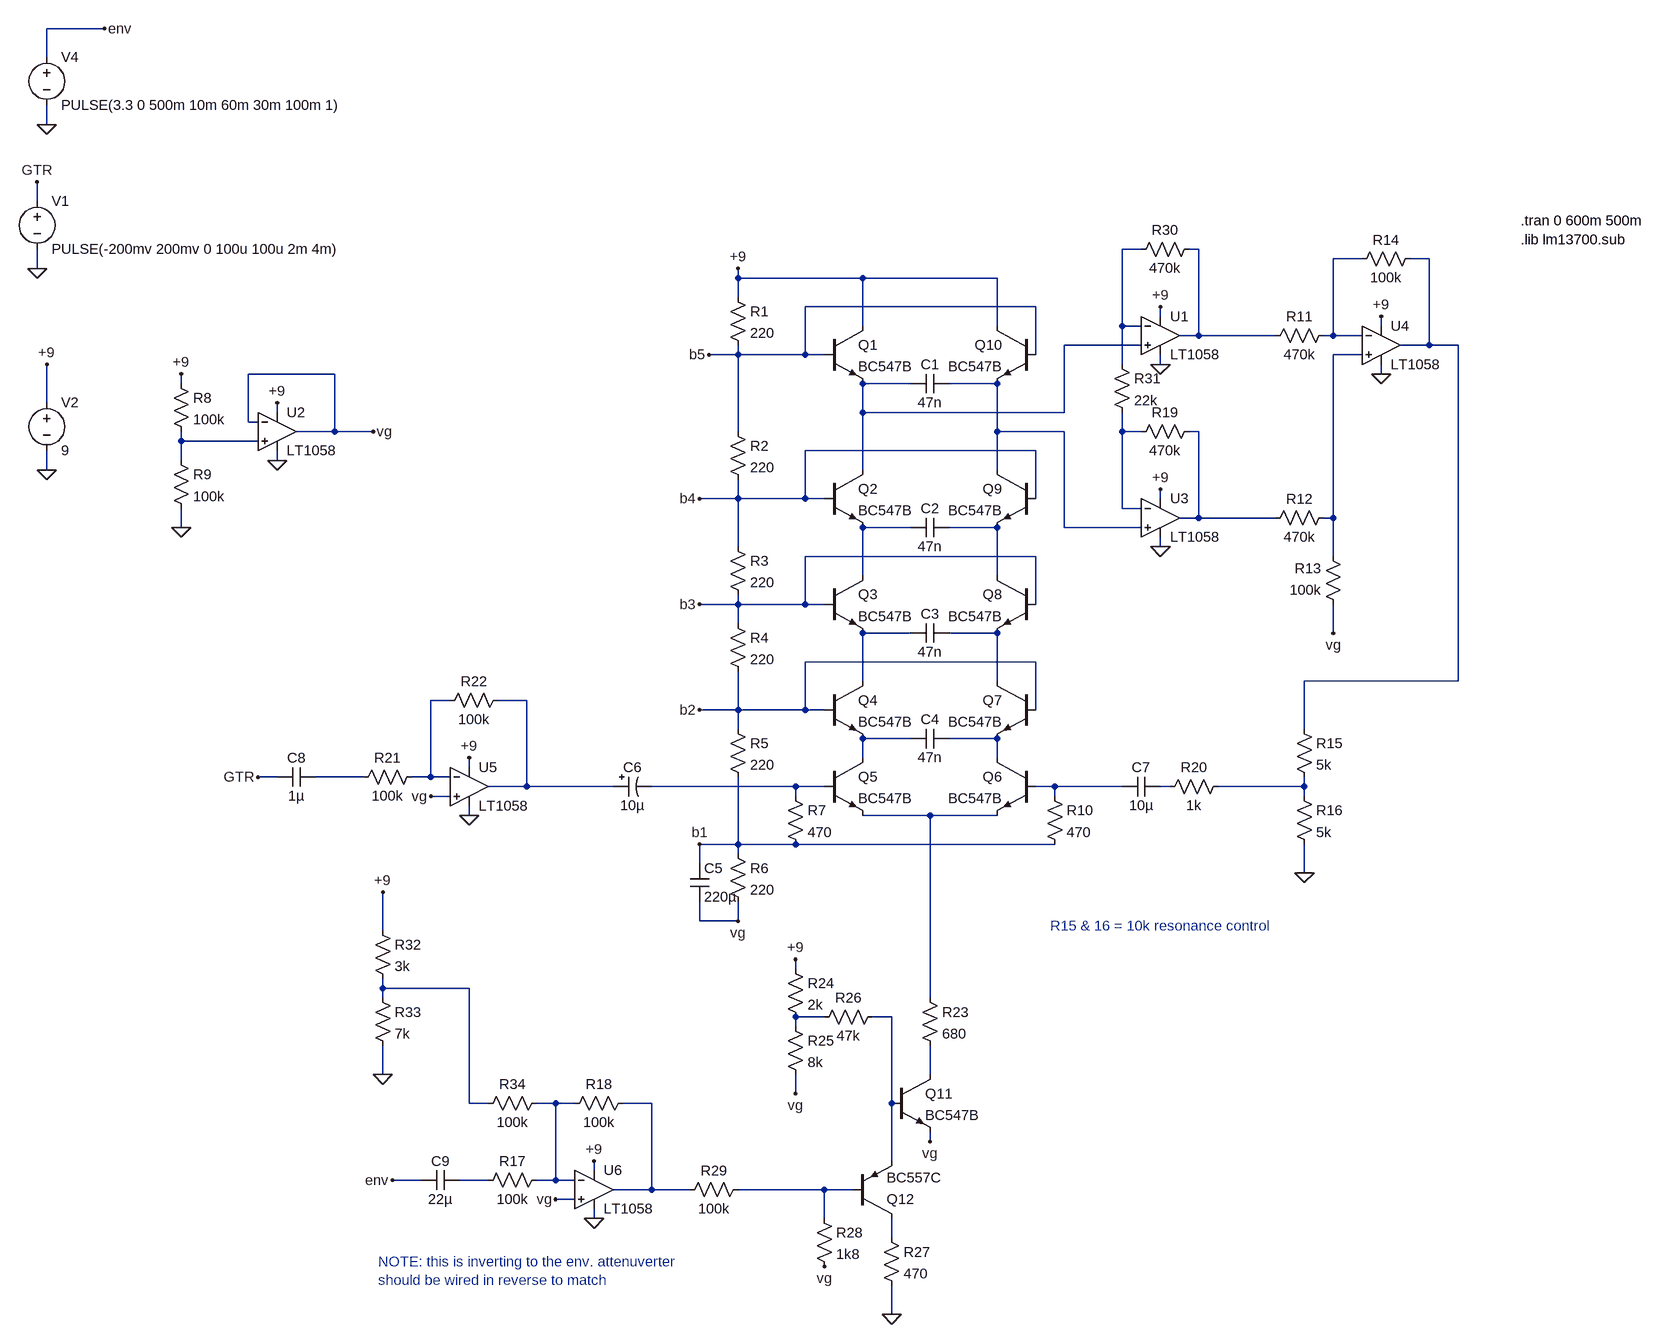
[diagram p0: schematic LadderFilterSim.asc]
LadderFilterSim.asc, the LTspice schematic file:
Version 4
SHEET 1 3420 5796
WIRE -3584 -208 -3680 -208
WIRE -3680 -160 -3680 -208
WIRE -3680 -48 -3680 -80
WIRE -3696 80 -3696 48
WIRE -1856 160 -1888 160
WIRE -1760 160 -1776 160
WIRE -1488 176 -1536 176
WIRE -1376 176 -1408 176
WIRE -3696 192 -3696 160
WIRE -2528 208 -2528 192
WIRE -2320 208 -2528 208
WIRE -2096 208 -2320 208
WIRE -2528 240 -2528 208
WIRE -2032 256 -2416 256
WIRE -1824 272 -1824 256
WIRE -2320 288 -2320 208
WIRE -2096 288 -2096 208
WIRE -1888 288 -1888 160
WIRE -1856 288 -1888 288
WIRE -1456 288 -1456 272
WIRE -1760 304 -1760 160
WIRE -1760 304 -1792 304
WIRE -1632 304 -1760 304
WIRE -1536 304 -1536 176
WIRE -1536 304 -1552 304
WIRE -1488 304 -1536 304
WIRE -1856 320 -1984 320
WIRE -1376 320 -1376 176
WIRE -1376 320 -1424 320
WIRE -1328 320 -1376 320
WIRE -2528 336 -2528 320
WIRE -2528 336 -2576 336
WIRE -2416 336 -2416 256
WIRE -2416 336 -2528 336
WIRE -2384 336 -2416 336
WIRE -2032 336 -2032 256
WIRE -1488 336 -1536 336
WIRE -1888 352 -1888 288
WIRE -1824 352 -1824 336
WIRE -3200 368 -3344 368
WIRE -1456 368 -1456 352
WIRE -3456 384 -3456 368
WIRE -2240 384 -2320 384
WIRE -2096 384 -2176 384
WIRE -3680 416 -3680 352
WIRE -3296 432 -3296 416
WIRE -2320 432 -2320 384
WIRE -1984 432 -1984 320
WIRE -1984 432 -2320 432
WIRE -3344 448 -3344 368
WIRE -3328 448 -3344 448
WIRE -3200 464 -3200 368
WIRE -3200 464 -3264 464
WIRE -3136 464 -3200 464
WIRE -2528 464 -2528 336
WIRE -2096 464 -2096 384
WIRE -1984 464 -2096 464
WIRE -1888 464 -1888 432
WIRE -1856 464 -1888 464
WIRE -1760 464 -1776 464
WIRE -3456 480 -3456 464
WIRE -3328 480 -3456 480
WIRE -2032 496 -2416 496
WIRE -3456 512 -3456 480
WIRE -3296 512 -3296 496
WIRE -3680 528 -3680 496
WIRE -2320 528 -2320 432
WIRE -2096 528 -2096 464
WIRE -2528 576 -2528 544
WIRE -2528 576 -2592 576
WIRE -2416 576 -2416 496
WIRE -2416 576 -2528 576
WIRE -2384 576 -2416 576
WIRE -2032 576 -2032 496
WIRE -1824 576 -1824 560
WIRE -1888 592 -1888 464
WIRE -1856 592 -1888 592
WIRE -1760 608 -1760 464
WIRE -1760 608 -1792 608
WIRE -1632 608 -1760 608
WIRE -1536 608 -1536 336
WIRE -1536 608 -1552 608
WIRE -3456 624 -3456 592
WIRE -2240 624 -2320 624
WIRE -2096 624 -2176 624
WIRE -1984 624 -1984 464
WIRE -1856 624 -1984 624
WIRE -2528 656 -2528 576
WIRE -1824 656 -1824 640
WIRE -2032 672 -2416 672
WIRE -1536 672 -1536 608
WIRE -2320 704 -2320 624
WIRE -2096 704 -2096 624
WIRE -2528 752 -2528 736
WIRE -2528 752 -2592 752
WIRE -2416 752 -2416 672
WIRE -2416 752 -2528 752
WIRE -2384 752 -2416 752
WIRE -2032 752 -2032 672
WIRE -2528 784 -2528 752
WIRE -2240 800 -2320 800
WIRE -2096 800 -2176 800
WIRE -1536 800 -1536 752
WIRE -2032 848 -2416 848
WIRE -2320 880 -2320 800
WIRE -2096 880 -2096 800
WIRE -1328 880 -1328 320
WIRE -1328 880 -1584 880
WIRE -3008 912 -3040 912
WIRE -2880 912 -2928 912
WIRE -2528 928 -2528 864
WIRE -2528 928 -2592 928
WIRE -2416 928 -2416 848
WIRE -2416 928 -2528 928
WIRE -2384 928 -2416 928
WIRE -2032 928 -2032 848
WIRE -2528 960 -2528 928
WIRE -1584 960 -1584 880
WIRE -2240 976 -2320 976
WIRE -2096 976 -2176 976
WIRE -2320 1008 -2320 976
WIRE -2096 1008 -2096 976
WIRE -2976 1024 -2976 1008
WIRE -3296 1040 -3328 1040
WIRE -3152 1040 -3232 1040
WIRE -3040 1040 -3040 912
WIRE -3040 1040 -3072 1040
WIRE -3008 1040 -3040 1040
WIRE -2880 1056 -2880 912
WIRE -2880 1056 -2944 1056
WIRE -2736 1056 -2880 1056
WIRE -2432 1056 -2672 1056
WIRE -2384 1056 -2432 1056
WIRE -2000 1056 -2032 1056
WIRE -1888 1056 -2000 1056
WIRE -1808 1056 -1824 1056
WIRE -1584 1056 -1584 1040
WIRE -1584 1056 -1728 1056
WIRE -3008 1072 -3040 1072
WIRE -2432 1072 -2432 1056
WIRE -2000 1072 -2000 1056
WIRE -1584 1072 -1584 1056
WIRE -2976 1104 -2976 1088
WIRE -2208 1104 -2320 1104
WIRE -2096 1104 -2208 1104
WIRE -2528 1152 -2528 1040
WIRE -2528 1152 -2592 1152
WIRE -2432 1152 -2528 1152
WIRE -2000 1152 -2432 1152
WIRE -2528 1168 -2528 1152
WIRE -2592 1184 -2592 1152
WIRE -1584 1200 -1584 1152
WIRE -2592 1280 -2592 1248
WIRE -2528 1280 -2528 1248
WIRE -2528 1280 -2592 1280
WIRE -3120 1296 -3120 1232
WIRE -2432 1360 -2432 1344
WIRE -3120 1392 -3120 1376
WIRE -2976 1392 -3120 1392
WIRE -3120 1408 -3120 1392
WIRE -2208 1408 -2208 1104
WIRE -2384 1440 -2432 1440
WIRE -2272 1440 -2304 1440
WIRE -2432 1456 -2432 1440
WIRE -3120 1536 -3120 1488
WIRE -2208 1536 -2208 1488
WIRE -2432 1568 -2432 1536
WIRE -2976 1584 -2976 1392
WIRE -2944 1584 -2976 1584
WIRE -2832 1584 -2864 1584
WIRE -2800 1584 -2832 1584
WIRE -2672 1584 -2720 1584
WIRE -2272 1584 -2272 1440
WIRE -2208 1648 -2208 1632
WIRE -2272 1680 -2272 1584
WIRE -2768 1696 -2768 1680
WIRE -3056 1712 -3104 1712
WIRE -2944 1712 -2992 1712
WIRE -2832 1712 -2832 1584
WIRE -2832 1712 -2864 1712
WIRE -2800 1712 -2832 1712
WIRE -2672 1728 -2672 1584
WIRE -2672 1728 -2736 1728
WIRE -2608 1728 -2672 1728
WIRE -2384 1728 -2528 1728
WIRE -2336 1728 -2384 1728
WIRE -2800 1744 -2832 1744
WIRE -2768 1776 -2768 1760
WIRE -2384 1776 -2384 1728
WIRE -2272 1808 -2272 1776
WIRE -2272 1936 -2272 1888
FLAG -3680 352 +9
FLAG -3680 -48 0
FLAG -3584 -208 env
FLAG -3696 192 0
FLAG -3696 48 GTR
FLAG -3296 416 +9
FLAG -3136 464 vg
FLAG -3456 368 +9
FLAG -3456 624 0
FLAG -2528 192 +9
FLAG -2528 1280 vg
FLAG -2592 1152 b1
FLAG -2592 928 b2
FLAG -2592 752 b3
FLAG -2592 576 b4
FLAG -2576 336 b5
FLAG -3680 528 0
FLAG -3328 1040 GTR
FLAG -3296 512 0
FLAG -1824 256 +9
FLAG -1824 352 0
FLAG -1824 560 +9
FLAG -1824 656 0
FLAG -1456 272 +9
FLAG -1456 368 0
FLAG -1536 800 vg
FLAG -1584 1200 0
FLAG -2976 1008 +9
FLAG -2976 1104 0
FLAG -3040 1072 vg
FLAG -2432 1344 +9
FLAG -2272 1936 0
FLAG -2384 1856 vg
FLAG -2432 1568 vg
FLAG -2208 1648 vg
FLAG -2768 1680 +9
FLAG -2768 1776 0
FLAG -2832 1744 vg
FLAG -3104 1712 env
FLAG -3120 1536 0
FLAG -3120 1232 +9
SYMBOL voltage -3680 400 R0
SYMATTR InstName V2
SYMATTR Value 9
SYMBOL voltage -3680 -176 R0
SYMATTR InstName V4
SYMATTR Value PULSE(3.3 0 500m 10m 60m 30m 100m 1)
SYMBOL voltage -3696 64 R0
SYMATTR InstName V1
SYMATTR Value PULSE(-200mv 200mv 0 100u 100u 2m 4m)
SYMBOL OpAmps/LT1058 -3296 400 R0
SYMATTR InstName U2
SYMBOL res -3472 368 R0
SYMATTR InstName R8
SYMATTR Value 100k
SYMBOL res -3472 496 R0
SYMATTR InstName R9
SYMATTR Value 100k
SYMBOL res -2544 224 R0
SYMATTR InstName R1
SYMATTR Value 220
SYMBOL res -2544 448 R0
SYMATTR InstName R2
SYMATTR Value 220
SYMBOL res -2544 640 R0
SYMATTR InstName R3
SYMATTR Value 220
SYMBOL res -2544 768 R0
SYMATTR InstName R4
SYMATTR Value 220
SYMBOL res -2544 944 R0
SYMATTR InstName R5
SYMATTR Value 220
SYMBOL res -2544 1152 R0
SYMATTR InstName R6
SYMATTR Value 220
SYMBOL npn -2384 288 R0
SYMATTR InstName Q1
SYMATTR Value BC547B
SYMBOL cap -2176 368 R90
WINDOW 0 0 32 VBottom 2
WINDOW 3 32 32 VTop 2
SYMATTR InstName C1
SYMATTR Value 47n
SYMBOL cap -2176 608 R90
WINDOW 0 0 32 VBottom 2
WINDOW 3 32 32 VTop 2
SYMATTR InstName C2
SYMATTR Value 47n
SYMBOL cap -2176 784 R90
WINDOW 0 0 32 VBottom 2
WINDOW 3 32 32 VTop 2
SYMATTR InstName C3
SYMATTR Value 47n
SYMBOL cap -2176 960 R90
WINDOW 0 0 32 VBottom 2
WINDOW 3 32 32 VTop 2
SYMATTR InstName C4
SYMATTR Value 47n
SYMBOL res -2448 1056 R0
SYMATTR InstName R7
SYMATTR Value 470
SYMBOL res -2016 1056 R0
SYMATTR InstName R10
SYMATTR Value 470
SYMBOL cap -2608 1184 R0
SYMATTR InstName C5
SYMATTR Value 220µ
SYMBOL OpAmps/LT1058 -1824 240 R0
SYMATTR InstName U1
SYMBOL OpAmps/LT1058 -1824 544 R0
SYMATTR InstName U3
SYMBOL OpAmps/LT1058 -1456 256 R0
SYMATTR InstName U4
SYMBOL res -1536 288 R90
WINDOW 0 0 56 VBottom 2
WINDOW 3 32 56 VTop 2
SYMATTR InstName R11
SYMATTR Value 470k
SYMBOL res -1536 592 R90
WINDOW 0 0 56 VBottom 2
WINDOW 3 32 56 VTop 2
SYMATTR InstName R12
SYMATTR Value 470k
SYMBOL res -1520 768 R180
WINDOW 0 36 76 Left 2
WINDOW 3 36 40 Left 2
SYMATTR InstName R13
SYMATTR Value 100k
SYMBOL res -1504 192 R270
WINDOW 0 32 56 VTop 2
WINDOW 3 0 56 VBottom 2
SYMATTR InstName R14
SYMATTR Value 100k
SYMBOL res -1600 944 R0
SYMATTR InstName R15
SYMATTR Value 5k
SYMBOL res -1600 1056 R0
SYMATTR InstName R16
SYMATTR Value 5k
SYMBOL npn -2384 528 R0
SYMATTR InstName Q2
SYMATTR Value BC547B
SYMBOL npn -2384 704 R0
SYMATTR InstName Q3
SYMATTR Value BC547B
SYMBOL npn -2384 880 R0
SYMATTR InstName Q4
SYMATTR Value BC547B
SYMBOL npn -2384 1008 R0
SYMATTR InstName Q5
SYMATTR Value BC547B
SYMBOL npn -2032 1008 M0
SYMATTR InstName Q6
SYMATTR Value BC547B
SYMBOL npn -2032 880 M0
SYMATTR InstName Q7
SYMATTR Value BC547B
SYMBOL npn -2032 704 M0
SYMATTR InstName Q8
SYMATTR Value BC547B
SYMBOL npn -2032 528 M0
SYMATTR InstName Q9
SYMATTR Value BC547B
SYMBOL npn -2032 288 M0
SYMATTR InstName Q10
SYMATTR Value BC547B
SYMBOL cap -1824 1040 R90
WINDOW 0 0 32 VBottom 2
WINDOW 3 32 32 VTop 2
SYMATTR InstName C7
SYMATTR Value 10µ
SYMBOL res -1712 1040 R90
WINDOW 0 0 56 VBottom 2
WINDOW 3 32 56 VTop 2
SYMATTR InstName R20
SYMATTR Value 1k
SYMBOL OpAmps/LT1058 -2976 992 R0
SYMATTR InstName U5
SYMBOL res -3056 1024 R90
WINDOW 0 0 56 VBottom 2
WINDOW 3 32 56 VTop 2
SYMATTR InstName R21
SYMATTR Value 100k
SYMBOL res -2912 896 R90
WINDOW 0 0 56 VBottom 2
WINDOW 3 32 56 VTop 2
SYMATTR InstName R22
SYMATTR Value 100k
SYMBOL cap -3232 1024 R90
WINDOW 0 0 32 VBottom 2
WINDOW 3 32 32 VTop 2
SYMATTR InstName C8
SYMATTR Value 1µ
SYMBOL npn -2272 1536 R0
SYMATTR InstName Q11
SYMATTR Value BC547B
SYMBOL res -2224 1392 R0
SYMATTR InstName R23
SYMATTR Value 680
SYMBOL res -2448 1344 R0
SYMATTR InstName R24
SYMATTR Value 2k
SYMBOL res -2448 1440 R0
SYMATTR InstName R25
SYMATTR Value 8k
SYMBOL res -2288 1424 R90
WINDOW 0 0 56 VBottom 2
WINDOW 3 32 56 VTop 2
SYMATTR InstName R26
SYMATTR Value 47k
SYMBOL pnp -2336 1776 M180
SYMATTR InstName Q12
SYMATTR Value BC557C
SYMBOL res -2288 1792 R0
SYMATTR InstName R27
SYMATTR Value 470
SYMBOL res -2400 1760 R0
SYMATTR InstName R28
SYMATTR Value 1k8
SYMBOL res -2512 1712 R90
WINDOW 0 0 56 VBottom 2
WINDOW 3 32 56 VTop 2
SYMATTR InstName R29
SYMATTR Value 100k
SYMBOL res -1760 448 R90
WINDOW 0 0 56 VBottom 2
WINDOW 3 32 56 VTop 2
SYMATTR InstName R19
SYMATTR Value 470k
SYMBOL res -1760 144 R90
WINDOW 0 0 56 VBottom 2
WINDOW 3 32 56 VTop 2
SYMATTR InstName R30
SYMATTR Value 470k
SYMBOL res -1904 336 R0
SYMATTR InstName R31
SYMATTR Value 22k
SYMBOL polcap -2736 1040 M90
WINDOW 0 0 32 VBottom 2
WINDOW 3 32 32 VTop 2
SYMATTR InstName C6
SYMATTR Value 10µ
SYMBOL OpAmps/LT1058 -2768 1664 R0
SYMATTR InstName U6
SYMBOL res -2848 1696 R90
WINDOW 0 0 56 VBottom 2
WINDOW 3 32 56 VTop 2
SYMATTR InstName R17
SYMATTR Value 100k
SYMBOL res -2704 1568 R90
WINDOW 0 0 56 VBottom 2
WINDOW 3 32 56 VTop 2
SYMATTR InstName R18
SYMATTR Value 100k
SYMBOL cap -2992 1696 R90
WINDOW 0 0 32 VBottom 2
WINDOW 3 32 32 VTop 2
SYMATTR InstName C9
SYMATTR Value 22µ
SYMBOL res -3136 1280 R0
SYMATTR InstName R32
SYMATTR Value 3k
SYMBOL res -3136 1392 R0
SYMATTR InstName R33
SYMATTR Value 7k
SYMBOL res -2848 1568 R90
WINDOW 0 0 56 VBottom 2
WINDOW 3 32 56 VTop 2
SYMATTR InstName R34
SYMATTR Value 100k
TEXT -40 112 Left 2 !.tran 0 600m 500m
TEXT -40 144 Left 2 !.lib lm13700.sub
TEXT -2008 1288 Left 2 ;R15 & 16 = 10k resonance control
TEXT -3128 1848 Left 2 ;NOTE: this is inverting to the env. attenuverter\nshould be wired in reverse to match

The netlist it stands for:
* LadderFilterSim.asc
V2 +9 0 9
V4 env 0 PULSE(3.3 0 500m 10m 60m 30m 100m 1)
V1 GTR 0 PULSE(-200mv 200mv 0 100u 100u 2m 4m)
XU2 N010 vg +9 0 vg LT1057  ; LT1058, pins In+ In- V+ V- OUT
R8 +9 N010 100k
R9 N010 0 100k
R1 +9 b5 220
R2 b5 b4 220
R3 b4 b3 220
R4 b3 b2 220
R5 b2 b1 220
R6 b1 vg 220
Q1 +9 b5 N005 0 BC547B
C1 N007 N005 47n
C2 N012 N011 47n
C3 N014 N013 47n
C4 N018 N017 47n
R7 N020 b1 470
R10 N021 b1 470
C5 b1 vg 220µ
XU1 N005 N001 +9 0 N002 LT1057  ; LT1058, pins In+ In- V+ V- OUT
XU3 N007 N008 +9 0 N009 LT1057  ; LT1058, pins In+ In- V+ V- OUT
XU4 N006 N003 +9 0 N004 LT1057  ; LT1058, pins In+ In- V+ V- OUT
R11 N003 N002 470k
R12 N006 N009 470k
R13 vg N006 100k
R14 N003 N004 100k
R15 N004 N023 5k
R16 N023 0 5k
Q2 N005 b4 N011 0 BC547B
Q3 N011 b3 N013 0 BC547B
Q4 N013 b2 N017 0 BC547B
Q5 N017 N020 N024 0 BC547B
Q6 N018 N021 N024 0 BC547B
Q7 N014 b2 N018 0 BC547B
Q8 N012 b3 N014 0 BC547B
Q9 N007 b4 N012 0 BC547B
Q10 +9 b5 N007 0 BC547B
C7 N022 N021 10µ
R20 N023 N022 1k
XU5 vg N015 +9 0 N016 LT1057  ; LT1058, pins In+ In- V+ V- OUT
R21 N015 N019 100k
R22 N016 N015 100k
C8 N019 GTR 1µ
Q11 N028 N027 vg 0 BC547B
R23 N024 N028 680
R24 +9 N026 2k
R25 N026 vg 8k
R26 N027 N026 47k
Q12 N033 N032 N027 0 BC557C
R27 N033 0 470
R28 N032 vg 1k8
R29 N032 N030 100k
R19 N009 N008 470k
R30 N002 N001 470k
R31 N001 N008 22k
C6 N016 N020 10µ
XU6 vg N029 +9 0 N030 LT1057  ; LT1058, pins In+ In- V+ V- OUT
R17 N029 N031 100k
R18 N030 N029 100k
C9 N031 env 22µ
R32 +9 N025 3k
R33 N025 0 7k
R34 N029 N025 100k
.model NPN NPN
.model PNP PNP
.lib standard.bjt
.tran 0 600m 500m
.lib lm13700.sub
* R15 & 16 = 10k resonance control
* NOTE: this is inverting to the env. attenuverter
* should be wired in reverse to match
.lib LTC.lib
.backanno
.end